# Altium schematic sheet 09-NORStatusLed.SchDoc
size A4
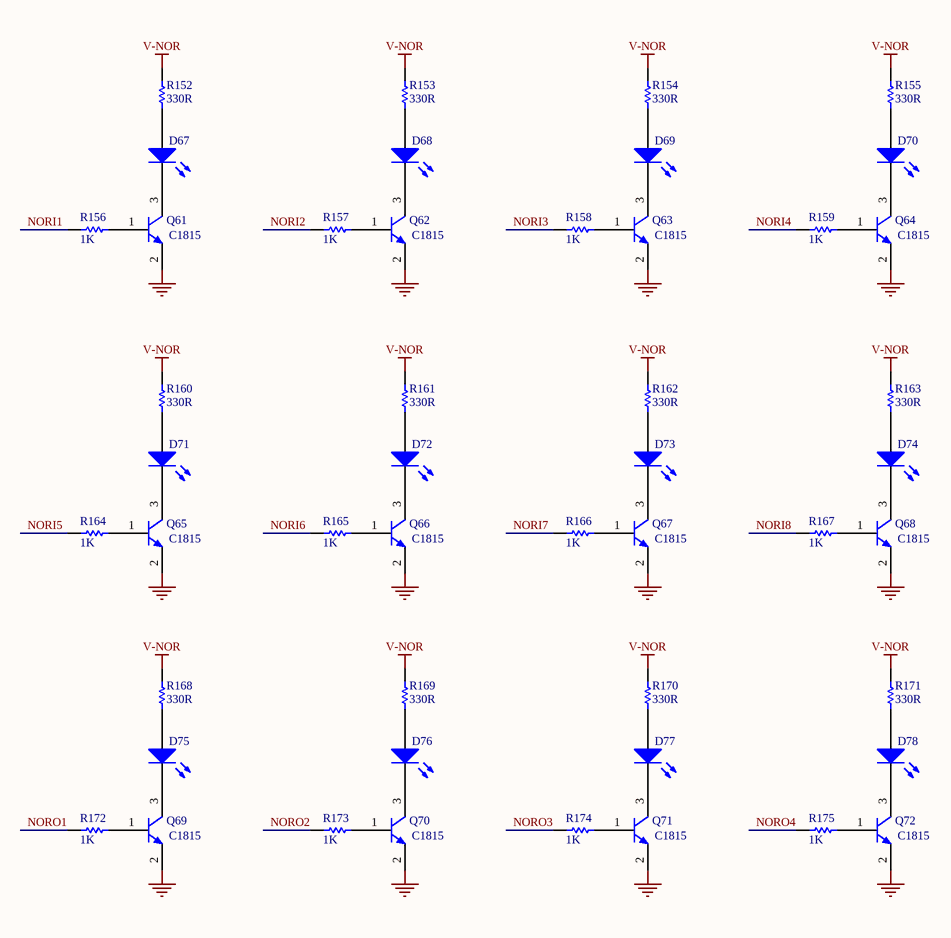
[diagram p0: 09-NORStatusLed.SchDoc]

## Parts
D67  LED  [LED-3528]  (value not drawn)
D68  LED  [LED-3528]  (value not drawn)
D69  LED  [LED-3528]  (value not drawn)
D70  LED  [LED-3528]  (value not drawn)
D71  LED  [LED-3528]  (value not drawn)
D72  LED  [LED-3528]  (value not drawn)
D73  LED  [LED-3528]  (value not drawn)
D74  LED  [LED-3528]  (value not drawn)
D75  LED  [LED-3528]  (value not drawn)
D76  LED  [LED-3528]  (value not drawn)
D77  LED  [LED-3528]  (value not drawn)
D78  LED  [LED-3528]  (value not drawn)
Q61  value C1815  [SOT23-321]  (hidden comment: C1815-SMD)
Q62  value C1815  [SOT23-321]  (hidden comment: C1815-SMD)
Q63  value C1815  [SOT23-321]  (hidden comment: C1815-SMD)
Q64  value C1815  [SOT23-321]  (hidden comment: C1815-SMD)
Q65  value C1815  [SOT23-321]  (hidden comment: C1815-SMD)
Q66  value C1815  [SOT23-321]  (hidden comment: C1815-SMD)
Q67  value C1815  [SOT23-321]  (hidden comment: C1815-SMD)
Q68  value C1815  [SOT23-321]  (hidden comment: C1815-SMD)
Q69  value C1815  [SOT23-321]  (hidden comment: C1815-SMD)
Q70  value C1815  [SOT23-321]  (hidden comment: C1815-SMD)
Q71  value C1815  [SOT23-321]  (hidden comment: C1815-SMD)
Q72  value C1815  [SOT23-321]  (hidden comment: C1815-SMD)
R152  330R  [R-0805]
R153  330R  [R-0805]
R154  330R  [R-0805]
R155  330R  [R-0805]
R156  1K  [R-0805]
R157  1K  [R-0805]
R158  1K  [R-0805]
R159  1K  [R-0805]
R160  330R  [R-0805]
R161  330R  [R-0805]
R162  330R  [R-0805]
R163  330R  [R-0805]
R164  1K  [R-0805]
R165  1K  [R-0805]
R166  1K  [R-0805]
R167  1K  [R-0805]
R168  330R  [R-0805]
R169  330R  [R-0805]
R170  330R  [R-0805]
R171  330R  [R-0805]
R172  1K  [R-0805]
R173  1K  [R-0805]
R174  1K  [R-0805]
R175  1K  [R-0805]

## Nets
GND: Q61.2(E) Q62.2(E) Q63.2(E) Q64.2(E) Q65.2(E) Q66.2(E) Q67.2(E) Q68.2(E) Q69.2(E) Q70.2(E) Q71.2(E) Q72.2(E)
V-NOR: R152.2 R153.2 R154.2 R155.2 R160.2 R161.2 R162.2 R163.2 R168.2 R169.2 R170.2 R171.2
NORI1: R156.2
NORI2: R157.2
NORI3: R158.2
NORI4: R159.2
NORI5: R164.2
NORI6: R165.2
NORI7: R166.2
NORI8: R167.2
NORO1: R172.2
NORO2: R173.2
NORO3: R174.2
NORO4: R175.2
NetD67_1: D67.1(A) R152.1
NetD67_2: D67.2(K) Q61.3(C)
NetD68_1: D68.1(A) R153.1
NetD68_2: D68.2(K) Q62.3(C)
NetD69_1: D69.1(A) R154.1
NetD69_2: D69.2(K) Q63.3(C)
NetD70_1: D70.1(A) R155.1
NetD70_2: D70.2(K) Q64.3(C)
NetD71_1: D71.1(A) R160.1
NetD71_2: D71.2(K) Q65.3(C)
NetD72_1: D72.1(A) R161.1
NetD72_2: D72.2(K) Q66.3(C)
NetD73_1: D73.1(A) R162.1
NetD73_2: D73.2(K) Q67.3(C)
NetD74_1: D74.1(A) R163.1
NetD74_2: D74.2(K) Q68.3(C)
NetD75_1: D75.1(A) R168.1
NetD75_2: D75.2(K) Q69.3(C)
NetD76_1: D76.1(A) R169.1
NetD76_2: D76.2(K) Q70.3(C)
NetD77_1: D77.1(A) R170.1
NetD77_2: D77.2(K) Q71.3(C)
NetD78_1: D78.1(A) R171.1
NetD78_2: D78.2(K) Q72.3(C)
NetQ61_1: Q61.1(B) R156.1
NetQ62_1: Q62.1(B) R157.1
NetQ63_1: Q63.1(B) R158.1
NetQ64_1: Q64.1(B) R159.1
NetQ65_1: Q65.1(B) R164.1
NetQ66_1: Q66.1(B) R165.1
NetQ67_1: Q67.1(B) R166.1
NetQ68_1: Q68.1(B) R167.1
NetQ69_1: Q69.1(B) R172.1
NetQ70_1: Q70.1(B) R173.1
NetQ71_1: Q71.1(B) R174.1
NetQ72_1: Q72.1(B) R175.1

## Library data of the parts
D67-D78 = LED2: Typical RED, GREEN, YELLOW, AMBER GaAs LED; Published: 8-Jun-2000; LatestRevisionDate: 17-Jul-2002; LatestRevisionNote: Re-released for DXP Platform.; PackageVersion: Feb-2002; PackageReference: 3.2X1.6X1.1; Publisher: Altium Limited; PackageDescription: SM LED; 2 Flat Leads
Q61-Q72 = NPN: NPN Bipolar Transistor; Published: 8-Jun-2000; LatestRevisionDate: 17-Jul-2002; LatestRevisionNote: Re-released for DXP Platform.; PackageReference: TO-226-AA; PackageDescription: TO, Flat Index; 3 In-Line, Axial Leads; Body Dia. 4.8mm; Leads 0.55 x 0.51 mm (max); Code_JEDEC: TO-226-AA
R152-R175 = Res1: Resistor; Published: 8-Jun-2000; LatestRevisionDate: 17-Jul-2002; LatestRevisionNote: Re-released for DXP Platform.; PackageReference: AXIAL-0.3; Publisher: Altium Limited; PackageDescription: Axial Device, Thru-Hole; 2 Leads; 0.3 in Pin Spacing
  R152-R155 R160-R163 R168-R171: Value: 330R
  R156-R159 R164-R167 R172-R175: Value: 1K